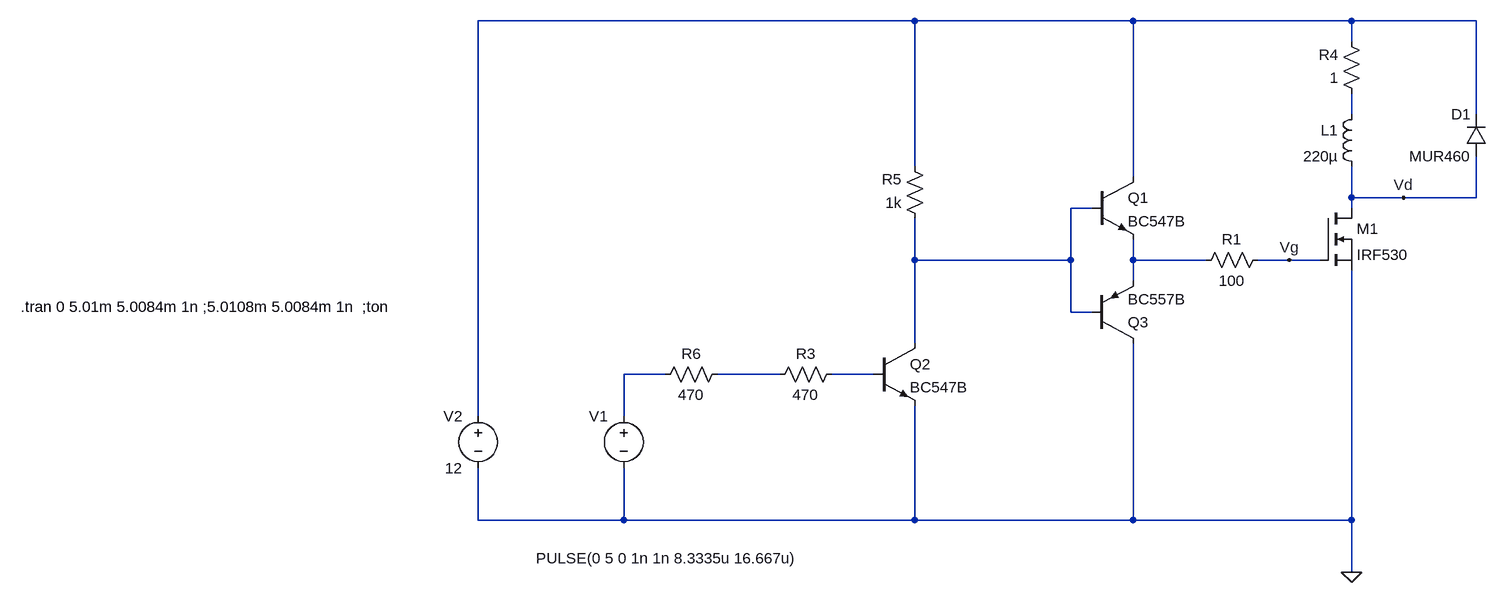
[diagram p0: schematic ON_commute.asc]
ON_commute.asc, the LTspice schematic file:
Version 4
SHEET 1 1800 800
WIRE 192 -352 -480 -352
WIRE 528 -352 192 -352
WIRE 864 -352 528 -352
WIRE 1056 -352 864 -352
WIRE 864 -320 864 -352
WIRE 864 -208 864 -240
WIRE 1056 -208 1056 -352
WIRE 192 -128 192 -352
WIRE 528 -112 528 -352
WIRE 864 -80 864 -128
WIRE 944 -80 864 -80
WIRE 1056 -80 1056 -144
WIRE 1056 -80 944 -80
WIRE 464 -64 432 -64
WIRE 864 -64 864 -80
WIRE 192 16 192 -48
WIRE 432 16 432 -64
WIRE 432 16 192 16
WIRE 528 16 528 -16
WIRE 640 16 528 16
WIRE 768 16 720 16
WIRE 816 16 768 16
WIRE 528 48 528 16
WIRE 432 96 432 16
WIRE 464 96 432 96
WIRE 192 144 192 16
WIRE -192 192 -256 192
WIRE -16 192 -112 192
WIRE 128 192 64 192
WIRE -480 256 -480 -352
WIRE -256 256 -256 192
WIRE -480 416 -480 336
WIRE -256 416 -256 336
WIRE -256 416 -480 416
WIRE 192 416 192 240
WIRE 192 416 -256 416
WIRE 528 416 528 144
WIRE 528 416 192 416
WIRE 864 416 864 32
WIRE 864 416 528 416
WIRE 864 496 864 416
FLAG 864 496 0
FLAG 768 16 Vg
FLAG 944 -80 Vd
SYMBOL npn 464 -112 R0
SYMATTR InstName Q1
SYMATTR Value BC547B
SYMBOL npn 128 144 R0
SYMATTR InstName Q2
SYMATTR Value BC547B
SYMBOL pnp 464 144 M180
SYMATTR InstName Q3
SYMATTR Value BC557B
SYMBOL nmos 816 -64 R0
SYMATTR InstName M1
SYMATTR Value IRF530
SYMBOL diode 1072 -144 R180
WINDOW 0 24 64 Left 2
WINDOW 3 24 0 Left 2
SYMATTR InstName D1
SYMATTR Value MUR460
SYMBOL res 736 0 R90
WINDOW 0 0 56 VBottom 2
WINDOW 3 32 56 VTop 2
SYMATTR InstName R1
SYMATTR Value 100
SYMBOL res 80 176 R90
WINDOW 0 0 56 VBottom 2
WINDOW 3 32 56 VTop 2
SYMATTR InstName R3
SYMATTR Value 470
SYMBOL res 880 -224 R180
WINDOW 0 36 76 Left 2
WINDOW 3 36 40 Left 2
SYMATTR InstName R4
SYMATTR Value 1
SYMBOL res 208 -32 R180
WINDOW 0 36 76 Left 2
WINDOW 3 36 40 Left 2
SYMATTR InstName R5
SYMATTR Value 1k
SYMBOL res -208 208 R270
WINDOW 0 32 56 VTop 2
WINDOW 3 0 56 VBottom 2
SYMATTR InstName R6
SYMATTR Value 470
SYMBOL ind 880 -224 M0
SYMATTR InstName L1
SYMATTR Value 220µ
SYMBOL voltage -256 240 M0
WINDOW 3 -270 235 Left 2
WINDOW 123 0 0 Left 0
WINDOW 39 0 0 Left 0
SYMATTR Value PULSE(0 5 0 1n 1n 8.3335u 16.667u)
SYMATTR InstName V1
SYMBOL voltage -480 240 M0
WINDOW 123 0 0 Left 0
WINDOW 39 0 0 Left 0
SYMATTR InstName V2
SYMATTR Value 12
TEXT -1184 88 Left 2 !.tran 0 5.01m 5.0084m 1n ;5.0108m 5.0084m 1n  ;ton

The netlist it stands for:
* ON_commute.asc
Q1 N001 N003 N004 0 BC547B
Q2 N003 N007 0 0 BC547B
Q3 0 N003 N004 0 BC557B
M1 Vd Vg 0 0 IRF530
D1 Vd N001 MUR460
R1 Vg N004 100
R3 N007 N006 470
R4 N002 N001 1
R5 N003 N001 1k
R6 N005 N006 470
L1 N002 Vd 220µ
V1 N005 0 PULSE(0 5 0 1n 1n 8.3335u 16.667u)
V2 N001 0 12
.model D D
.lib standard.dio
.model NPN NPN
.model PNP PNP
.lib standard.bjt
.model NMOS NMOS
.model PMOS PMOS
.lib standard.mos
.tran 0 5.01m 5.0084m 1n ;5.0108m 5.0084m 1n  ;ton
.backanno
.end